# EAGLE design wemosRx (EAGLE 9.6.1)
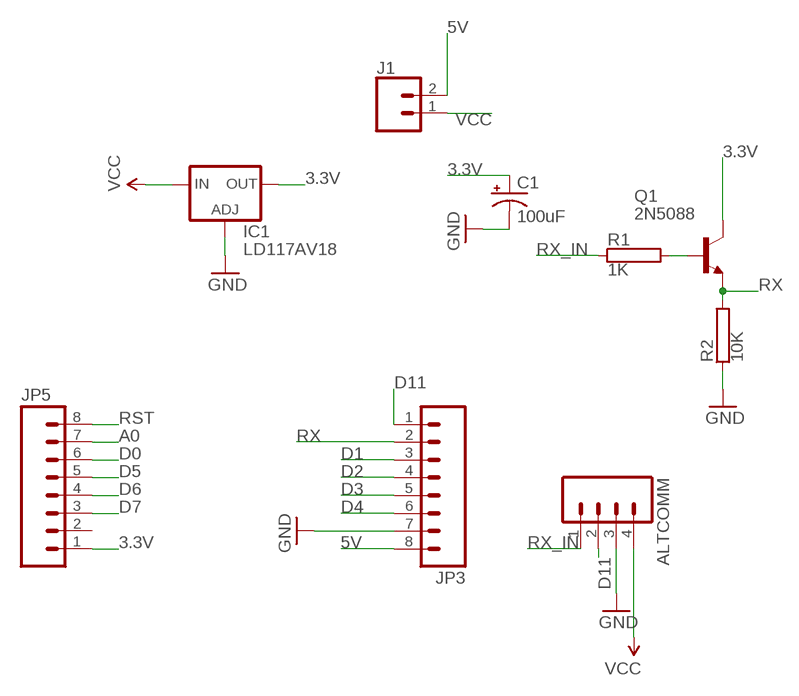
[diagram p0: schematic, sheet 1]

## Parts
ALTCOMM  M04LONGPADS  [1X04_LONGPADS@1]
C1  100uF  100UF-POLAR-RADIAL-2.5MM-25V-20%  [CPOL-RADIAL-2.5MM-6.5MM]
IC1  LD117AV18  [TO220L1]
J1  CONN_02  [1X02]
JP3  M08LONGPADS  [1X08_LONGPADS]
JP5  M08LONGPADS  [1X08_LONGPADS]
Q1  2N5088  [TO92]
R1  1K  RRS1/4  [RS1/4]
R2  10K  RRS1/4  [RS1/4]

## Nets
3.3V: C1.1(+) IC1.2(OUT) JP5.1 Q1.1(C)
5V: J1.2 JP3.8
A0: JP5.7
D0: JP5.6
D1: JP3.3
D2: JP3.4
D3: JP3.5
D4: JP3.6
D5: JP5.5
D6: JP5.4
D7: JP5.3
D11: ALTCOMM.2 JP3.1
GND: ALTCOMM.3 C1.2(-) IC1.1(ADJ) JP3.7 R2.1
N$1: Q1.2(B) R1.2
RST: JP5.8
RX: JP3.2 Q1.3(E) R2.2
RX_IN: ALTCOMM.1 R1.1
VCC: ALTCOMM.4 IC1.3(IN) J1.1
Unconnected: JP5.2

## Library data of the parts
ALTCOMM = SparkFun-Connectors:M04: Header 4 Standard 4-pin 0.1" header. Use with straight break away headers (SKU : PRT-00116), right angle break away headers (PRT-00553), swiss pins (PRT-00743), machine pins (PRT-00117), and female headers (PRT-00115). Molex polarized connector foot print use with SKU : PRT-08231 with associated crimp pins and housings. 1MM SMD Version SKU: PRT-10208
C1 = SparkFun-Capacitors:100UF-POLAR: 100µF polarized capacitors A capacitor is a passive two-terminal electrical component used to store electrical energy temporarily in an electric field.; PROD_ID: CAP-08439
IC1 = v-reg:LD117A?*: Low drop fixed and adjustable positive voltage regulators 1 A Source: http://www.st.com/stonline/products/literature/ds/7194/ld1117axx.pdf
J1 = SparkFun-Connectors:CONN_02: Multi connection point. Often used as Generic Header-pin footprint for 0.1 inch spaced/style header connections On any of the 0.1 inch spaced packages, you can populate with these: Break Away Headers - Straight <https://www.sparkfun.com/products/116> (PRT-00116) Break Away Male Headers - Right Angle <https://www.sparkfun.com/products/553> (PRT-00553) Female Headers <https://www.sparkfun.com/products/115> (PRT-00115) Break Away Headers - Machine Pin <https://www.sparkfun.com/products/117> (PRT-00117) Break Away Female Headers - Swiss Machine Pin <https://www.sparkfun.com/products/743> (PRT-00743) For SCREWTERMINALS and SPRING TERMINALS visit here: Screw Terimnals on SparkFun.com <https://www.sparkfun.com/search/results?term=Screw+Terminals> (5mm/3.5mm/2.54mm spacing) This device is also useful as a general connection point to wire up your design to another part of your project. Our various solder wires solder well into these plated through hole pads. Hook-Up Wire - Assortment (Stranded, 22 AWG) <https://www.sparkfun.com/products/11375> (PRT-11375) Hook-Up Wire - Assortment (Solid Core, 22 AWG) <https://www.sparkfun.com/products/11367> (PRT-11367) View the entire wire category on our website here <https://www.sparkfun.com/categories/141> Special notes: Molex polarized connector foot print use with: PRT-08233 with associated crimp pins and housings. 2.54_SCREWTERM for use with PRT-10571. 3.5mm Screw Terminal footprints for PRT-08084 5mm Screw Terminal footprints for use with PRT-08432
JP3 JP5 = SparkFun-Connectors:M08: Header 8 Standard 8-pin 0.1" header. Use with straight break away headers (SKU : PRT-00116), right angle break away headers (PRT-00553), swiss pins (PRT-00743), machine pins (PRT-00117), and female headers (PRT-00115).
Q1 = transistor-npn:2N5088: NPN Transistor
R1 R2 = resistor-power:R: Power Resitor; MF: OHMITE; MPN: RRS1K0; OC_FARNELL: unknown; OC_NEWARK: 01F7661

## Board
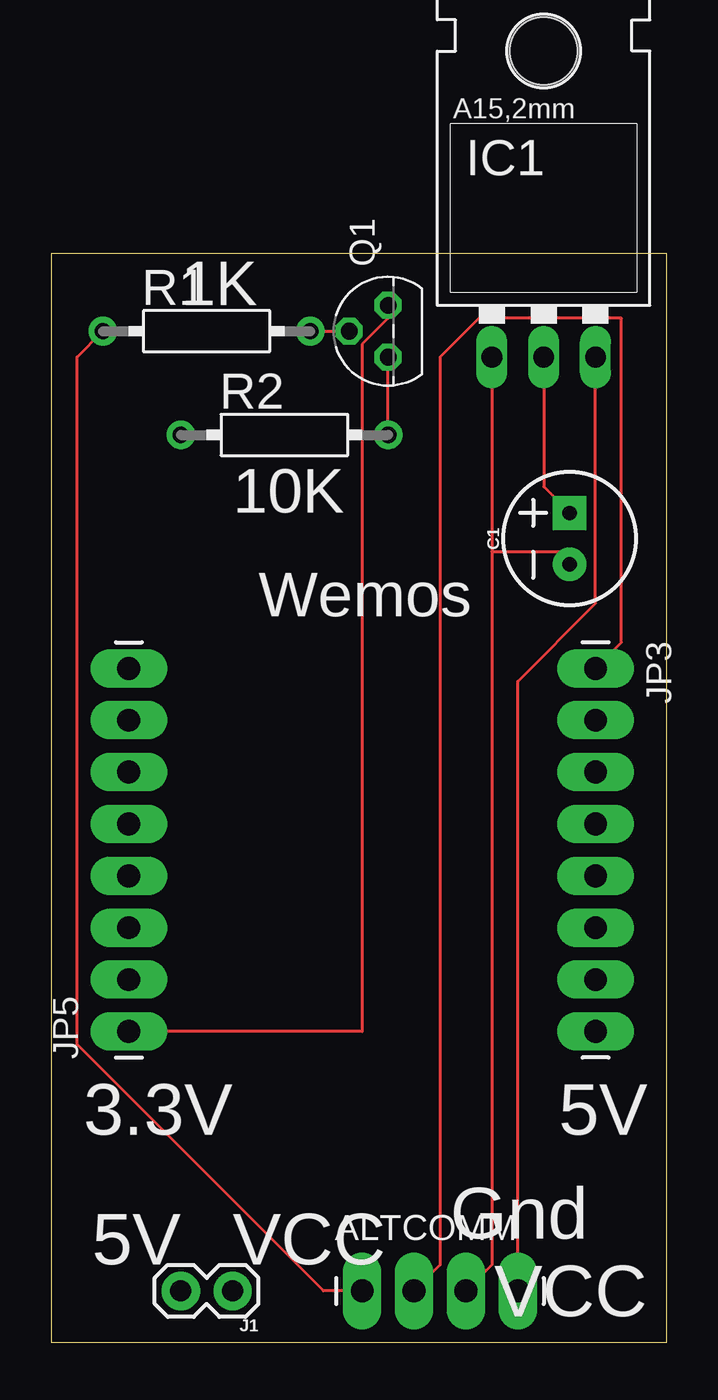
[diagram p1: board, top side]
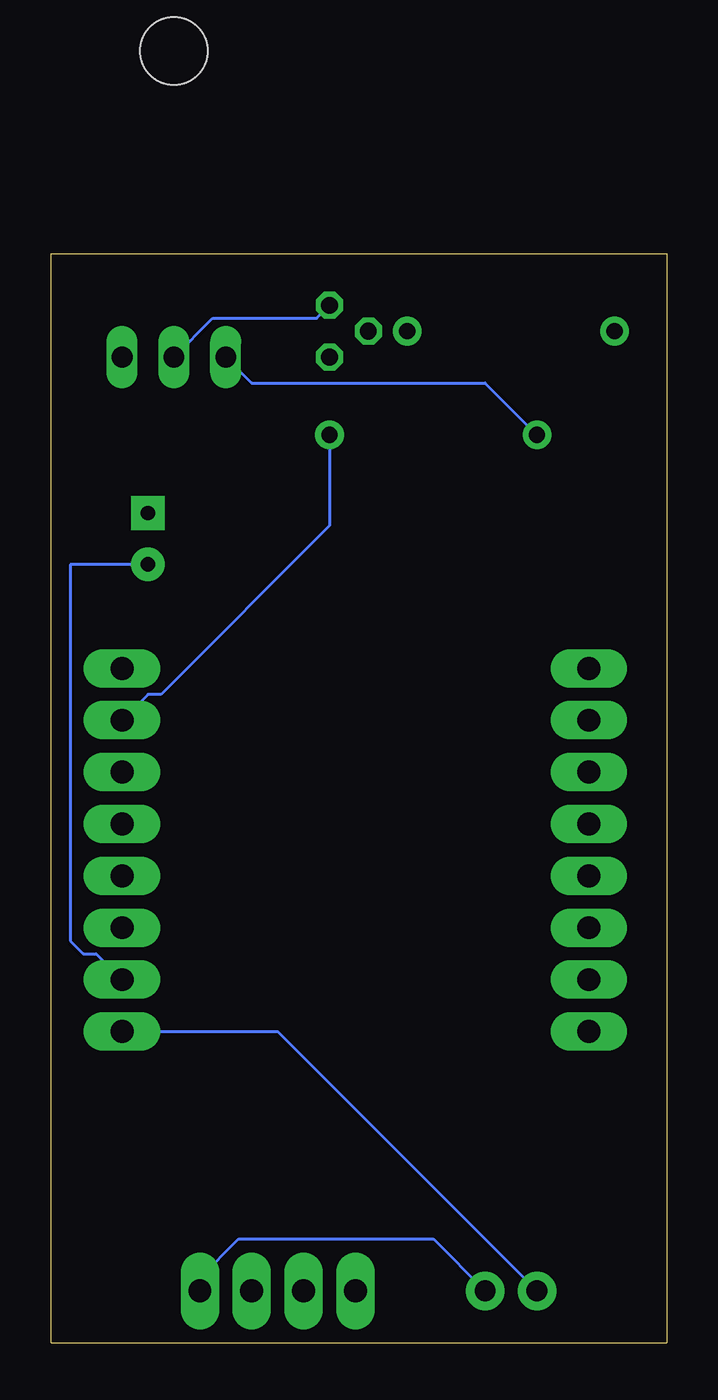
[diagram p2: board, bottom side, seen from below]

Size 30.15 x 53.34 mm. Coordinates in mm from the lower left corner, seen from the top.
Outline: 30.15,0 30.15,53.34 0,53.34 0,0 30.15,0
Copper layers (1*16): Top 0.035mm / dielectric 1.5mm / Bottom 0.035mm
Design rules "SeeedStudio_2layer_DRU_no_angle_20140221": minimum track width 6mil, minimum drill 12mil, track to track 6mil, track to pad 6mil, pad to pad 6mil, via to via 6mil, smd to smd 0mil, copper to edge 10mil, drill to drill 10mil, minimum pad ring 10mil, minimum via ring 6mil, stop-mask expansion 2mil, vias tented up to drill 100mil, thermal gap 10mil

### Footprints (pad centres in the part's own frame; a part is rotated, then mirrored left to right if it is on the bottom)
1X04_LONGPADS@1 = drill 1.118 pad 1.88 long: 1 0,0; 2 2.54,0; 3 5.08,0; 4 7.62,0
CPOL-RADIAL-2.5MM-6.5MM = drill 0.7 pad 1.651 square: 1 1.25,0 | drill 0.7 pad 1.651: 2 -1.25,0
TO220L1 = drill 1.016 long: 1 -2.54,-3.81; 2 0,-3.81; 3 2.54,-3.81 | hole 3.302: 0,11.176
1X02 = drill 1.016 pad 1.88: 1 0,0; 2 2.54,0
1X08_LONGPADS = drill 1.118 pad 1.88 long: 1 0,0; 2 2.54,0; 3 5.08,0; 4 7.62,0; 5 10.16,0; 6 12.7,0; 7 15.24,0; 8 17.78,0
TO92 = drill 0.813 octagon: 1 1.27,0; 2 0,1.905; 3 -1.27,0
RS1/4 = drill 0.8 pad 1.4: 1 -5.08,0; 2 5.08,0

### Placement (x,y rotation side)
ALTCOMM  15.24,2.55 0 top
C1  25.4,39.38 90 top
IC1  24.13,52.08 0 top
J1  8.89,2.55 180 top
JP3  26.67,33.03 270 top
JP5  3.81,15.25 90 top
Q1  16.51,49.54 90 top
R1  7.62,49.54 0 top
R2  11.43,44.46 0 top

### Tracks (layer width: path | path; a pad name or v marks a point on that pad's centre or on a via)
3.3V
  Top 0.152: IC1.2 24.13,41.92 25.4,40.65 C1.1 | JP5.1 15.24,15.25 15.24,48.9 16.51,50.18 Q1.1
  Bottom 0.152: Q1.1 17.14,50.18 22.22,50.18 IC1.2
5V
  Bottom 0.152: J1.2 19.05,15.25 JP3.8
D11
  Top 0.152: ALTCOMM.2 19.05,3.82 19.05,48.27 20.96,50.18 27.94,50.18 27.94,34.3 JP3.1
GND
  Top 0.152: 21.59,38.74 25.4,38.74 C1.2 | IC1.1 21.59,38.74 | ALTCOMM.3 21.59,3.82 21.59,38.74
  Bottom 0.152: R2.1 8.89,47 20.32,47 IC1.1 | JP3.7 27.94,19.06 28.57,19.06 29.21,19.7 29.21,38.11 25.4,38.11 C1.2
N$1
  Top 0.152: R1.2 Q1.2
RX
  Top 0.152: R2.2 Q1.3
  Bottom 0.152: JP3.2 25.4,31.76 24.76,31.76 16.51,40.01 R2.2
RX_IN
  Top 0.152: R1.1 1.27,48.27 1.27,14.62 13.33,2.55 ALTCOMM.1
VCC
  Top 0.152: IC1.3 26.67,36.21 22.86,32.4 ALTCOMM.4
  Bottom 0.152: J1.1 11.43,5.09 20.96,5.09 22.86,3.18 ALTCOMM.4

### Text on the board
_tsilk: 1K | 10K | Wemos | 3.3V | 5V | 5V | Gnd | VCC | VCC